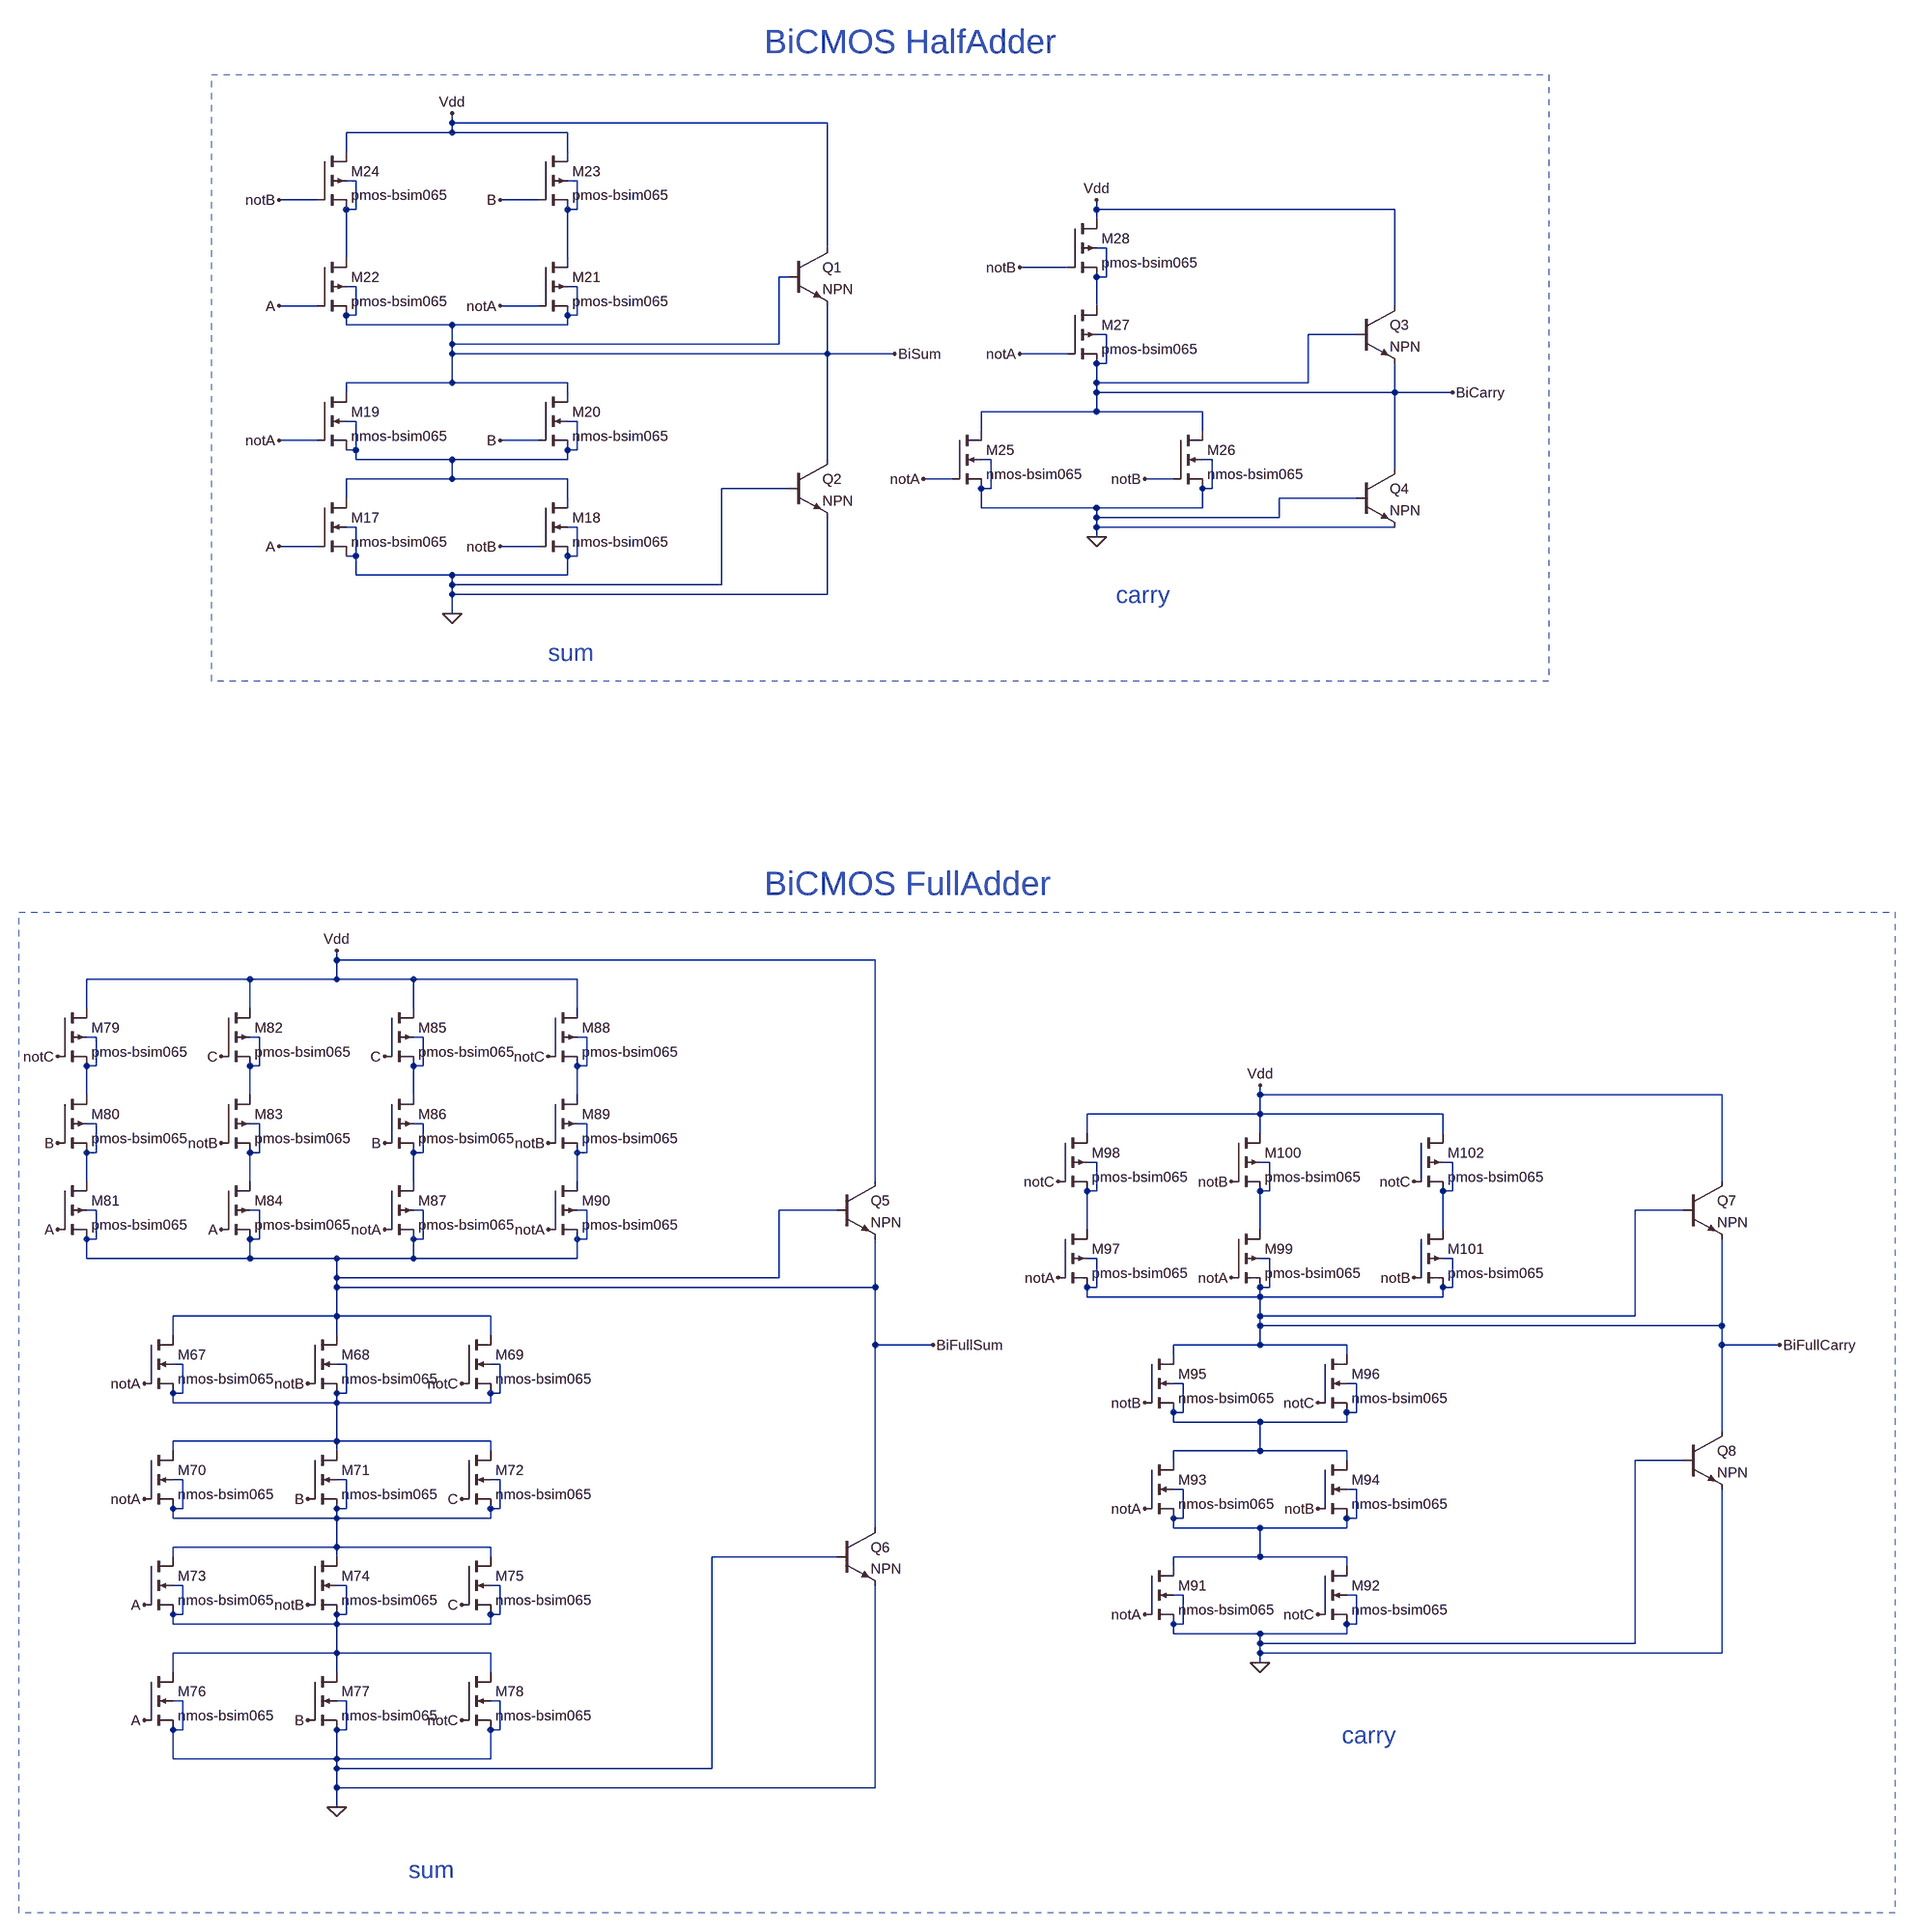
[diagram p0: schematic FullAdder Bicmos.asc]
FullAdder Bicmos.asc, the LTspice schematic file:
Version 4.1
SHEET 1 5276 2964
WIRE -864 -16 -864 -32
WIRE -240 -16 -864 -16
WIRE -864 0 -864 -16
WIRE -864 0 -1040 0
WIRE -672 0 -864 0
WIRE -1040 32 -1040 0
WIRE -672 32 -672 0
WIRE -1024 80 -1040 80
WIRE -656 80 -672 80
WIRE -1088 112 -1152 112
WIRE -720 112 -784 112
WIRE -1024 128 -1024 80
WIRE -1024 128 -1040 128
WIRE -656 128 -656 80
WIRE -656 128 -672 128
WIRE 208 128 208 112
WIRE 704 128 208 128
WIRE 208 144 208 128
WIRE -240 192 -240 -16
WIRE 224 192 208 192
WIRE -1040 208 -1040 128
WIRE -672 208 -672 128
WIRE 160 224 80 224
WIRE -304 240 -320 240
WIRE 224 240 224 192
WIRE 224 240 208 240
WIRE -1024 256 -1040 256
WIRE -656 256 -672 256
WIRE -1088 288 -1152 288
WIRE -720 288 -784 288
WIRE 208 288 208 240
WIRE 704 288 704 128
WIRE -1024 304 -1024 256
WIRE -1024 304 -1040 304
WIRE -656 304 -656 256
WIRE -656 304 -672 304
WIRE -1040 320 -1040 304
WIRE -864 320 -1040 320
WIRE -672 320 -672 304
WIRE -672 320 -864 320
WIRE 224 336 208 336
WIRE 640 336 560 336
WIRE -864 352 -864 320
WIRE -320 352 -320 240
WIRE -320 352 -864 352
WIRE -864 368 -864 352
WIRE -240 368 -240 288
WIRE -240 368 -864 368
WIRE -128 368 -240 368
WIRE 160 368 80 368
WIRE 224 384 224 336
WIRE 224 384 208 384
WIRE -864 416 -864 368
WIRE -864 416 -1040 416
WIRE -672 416 -864 416
WIRE 208 416 208 384
WIRE 560 416 560 336
WIRE 560 416 208 416
WIRE -1040 432 -1040 416
WIRE -672 432 -672 416
WIRE 208 432 208 416
WIRE 704 432 704 384
WIRE 704 432 208 432
WIRE 800 432 704 432
WIRE 208 464 208 432
WIRE 208 464 16 464
WIRE 384 464 208 464
WIRE -1024 480 -1040 480
WIRE -656 480 -672 480
WIRE 16 496 16 464
WIRE 384 496 384 464
WIRE -1088 512 -1152 512
WIRE -720 512 -784 512
WIRE -1024 528 -1024 480
WIRE -1024 528 -1040 528
WIRE -656 528 -656 480
WIRE -656 528 -672 528
WIRE -1024 544 -1024 528
WIRE -864 544 -1024 544
WIRE -672 544 -672 528
WIRE -672 544 -864 544
WIRE -240 544 -240 368
WIRE 32 544 16 544
WIRE 400 544 384 544
WIRE 704 560 704 432
WIRE -864 576 -864 544
WIRE -864 576 -1040 576
WIRE -672 576 -864 576
WIRE -32 576 -80 576
WIRE 336 576 288 576
WIRE -304 592 -416 592
WIRE 32 592 32 544
WIRE 32 592 16 592
WIRE 400 592 400 544
WIRE 400 592 384 592
WIRE -1040 608 -1040 576
WIRE -672 608 -672 576
WIRE 640 608 512 608
WIRE 16 624 16 592
WIRE 208 624 16 624
WIRE 384 624 384 592
WIRE 384 624 208 624
WIRE 208 640 208 624
WIRE 512 640 512 608
WIRE 512 640 208 640
WIRE -1024 656 -1040 656
WIRE -656 656 -672 656
WIRE 208 656 208 640
WIRE 704 656 208 656
WIRE 208 672 208 656
WIRE -1088 688 -1152 688
WIRE -720 688 -784 688
WIRE -1024 704 -1024 656
WIRE -1024 704 -1040 704
WIRE -656 704 -656 656
WIRE -656 704 -672 704
WIRE -1024 736 -1024 704
WIRE -864 736 -1024 736
WIRE -672 736 -672 704
WIRE -672 736 -864 736
WIRE -864 752 -864 736
WIRE -416 752 -416 592
WIRE -416 752 -864 752
WIRE -864 768 -864 752
WIRE -240 768 -240 640
WIRE -240 768 -864 768
WIRE -864 800 -864 768
WIRE -1056 1376 -1056 1360
WIRE -160 1376 -1056 1376
WIRE -1200 1408 -1472 1408
WIRE -1056 1408 -1056 1376
WIRE -1056 1408 -1200 1408
WIRE -928 1408 -1056 1408
WIRE -656 1408 -928 1408
WIRE -1472 1456 -1472 1408
WIRE -1200 1456 -1200 1408
WIRE -928 1456 -928 1408
WIRE -656 1456 -656 1408
WIRE -1456 1504 -1472 1504
WIRE -1184 1504 -1200 1504
WIRE -912 1504 -928 1504
WIRE -640 1504 -656 1504
WIRE -1456 1552 -1456 1504
WIRE -1456 1552 -1472 1552
WIRE -1184 1552 -1184 1504
WIRE -1184 1552 -1200 1552
WIRE -912 1552 -912 1504
WIRE -912 1552 -928 1552
WIRE -640 1552 -640 1504
WIRE -640 1552 -656 1552
WIRE -1472 1600 -1472 1552
WIRE -1200 1600 -1200 1552
WIRE -928 1600 -928 1552
WIRE -656 1600 -656 1552
WIRE 480 1600 480 1584
WIRE 1248 1600 480 1600
WIRE 480 1632 480 1600
WIRE 480 1632 192 1632
WIRE 784 1632 480 1632
WIRE -1456 1648 -1472 1648
WIRE -1184 1648 -1200 1648
WIRE -912 1648 -928 1648
WIRE -640 1648 -656 1648
WIRE 192 1664 192 1632
WIRE 480 1664 480 1632
WIRE 784 1664 784 1632
WIRE -1456 1696 -1456 1648
WIRE -1456 1696 -1472 1696
WIRE -1184 1696 -1184 1648
WIRE -1184 1696 -1200 1696
WIRE -912 1696 -912 1648
WIRE -912 1696 -928 1696
WIRE -640 1696 -640 1648
WIRE -640 1696 -656 1696
WIRE 208 1712 192 1712
WIRE 496 1712 480 1712
WIRE 800 1712 784 1712
WIRE -1472 1744 -1472 1696
WIRE -1200 1744 -1200 1696
WIRE -928 1744 -928 1696
WIRE -656 1744 -656 1696
WIRE -160 1744 -160 1376
WIRE 1248 1744 1248 1600
WIRE 208 1760 208 1712
WIRE 208 1760 192 1760
WIRE 496 1760 496 1712
WIRE 496 1760 480 1760
WIRE 800 1760 800 1712
WIRE 800 1760 784 1760
WIRE -1456 1792 -1472 1792
WIRE -1184 1792 -1200 1792
WIRE -912 1792 -928 1792
WIRE -640 1792 -656 1792
WIRE -224 1792 -320 1792
WIRE 1184 1792 1104 1792
WIRE 192 1824 192 1760
WIRE 480 1824 480 1760
WIRE 784 1824 784 1760
WIRE -1456 1840 -1456 1792
WIRE -1456 1840 -1472 1840
WIRE -1184 1840 -1184 1792
WIRE -1184 1840 -1200 1840
WIRE -912 1840 -912 1792
WIRE -912 1840 -928 1840
WIRE -640 1840 -640 1792
WIRE -640 1840 -656 1840
WIRE -1472 1872 -1472 1840
WIRE -1200 1872 -1200 1840
WIRE -1200 1872 -1472 1872
WIRE -1056 1872 -1200 1872
WIRE -928 1872 -928 1840
WIRE -928 1872 -1056 1872
WIRE -656 1872 -656 1840
WIRE -656 1872 -928 1872
WIRE 208 1872 192 1872
WIRE 496 1872 480 1872
WIRE 800 1872 784 1872
WIRE -1056 1904 -1056 1872
WIRE -320 1904 -320 1792
WIRE -320 1904 -1056 1904
WIRE -1056 1920 -1056 1904
WIRE -160 1920 -160 1840
WIRE -160 1920 -1056 1920
WIRE 208 1920 208 1872
WIRE 208 1920 192 1920
WIRE 496 1920 496 1872
WIRE 496 1920 480 1920
WIRE 800 1920 800 1872
WIRE 800 1920 784 1920
WIRE 192 1936 192 1920
WIRE 480 1936 480 1920
WIRE 480 1936 192 1936
WIRE 784 1936 784 1920
WIRE 784 1936 480 1936
WIRE -1056 1968 -1056 1920
WIRE -1056 1968 -1328 1968
WIRE -800 1968 -1056 1968
WIRE 480 1968 480 1936
WIRE 1104 1968 1104 1792
WIRE 1104 1968 480 1968
WIRE 480 1984 480 1968
WIRE 1248 1984 1248 1840
WIRE 1248 1984 480 1984
WIRE -1328 2000 -1328 1968
WIRE -1056 2000 -1056 1968
WIRE -800 2000 -800 1968
WIRE -160 2016 -160 1920
WIRE -64 2016 -160 2016
WIRE 480 2016 480 1984
WIRE 480 2016 336 2016
WIRE 624 2016 480 2016
WIRE 1248 2016 1248 1984
WIRE 1344 2016 1248 2016
WIRE 336 2032 336 2016
WIRE 624 2032 624 2016
WIRE -1312 2048 -1328 2048
WIRE -1040 2048 -1056 2048
WIRE -784 2048 -800 2048
WIRE 352 2080 336 2080
WIRE 640 2080 624 2080
WIRE -1312 2096 -1312 2048
WIRE -1312 2096 -1328 2096
WIRE -1040 2096 -1040 2048
WIRE -1040 2096 -1056 2096
WIRE -784 2096 -784 2048
WIRE -784 2096 -800 2096
WIRE -1328 2112 -1328 2096
WIRE -1056 2112 -1056 2096
WIRE -1056 2112 -1328 2112
WIRE -800 2112 -800 2096
WIRE -800 2112 -1056 2112
WIRE 352 2128 352 2080
WIRE 352 2128 336 2128
WIRE 640 2128 640 2080
WIRE 640 2128 624 2128
WIRE 336 2144 336 2128
WIRE 480 2144 336 2144
WIRE 624 2144 624 2128
WIRE 624 2144 480 2144
WIRE 1248 2160 1248 2016
WIRE -1056 2176 -1056 2112
WIRE -1056 2176 -1328 2176
WIRE -800 2176 -1056 2176
WIRE -1328 2192 -1328 2176
WIRE -1056 2192 -1056 2176
WIRE -800 2192 -800 2176
WIRE 480 2192 480 2144
WIRE 480 2192 336 2192
WIRE 624 2192 480 2192
WIRE 336 2208 336 2192
WIRE 624 2208 624 2192
WIRE 1184 2208 1104 2208
WIRE -1312 2240 -1328 2240
WIRE -1040 2240 -1056 2240
WIRE -784 2240 -800 2240
WIRE 352 2256 336 2256
WIRE 640 2256 624 2256
WIRE -1312 2288 -1312 2240
WIRE -1312 2288 -1328 2288
WIRE -1040 2288 -1040 2240
WIRE -1040 2288 -1056 2288
WIRE -784 2288 -784 2240
WIRE -784 2288 -800 2288
WIRE -1328 2304 -1328 2288
WIRE -1056 2304 -1056 2288
WIRE -1056 2304 -1328 2304
WIRE -800 2304 -800 2288
WIRE -800 2304 -1056 2304
WIRE 352 2304 352 2256
WIRE 352 2304 336 2304
WIRE 640 2304 640 2256
WIRE 640 2304 624 2304
WIRE -160 2320 -160 2016
WIRE 336 2320 336 2304
WIRE 480 2320 336 2320
WIRE 624 2320 624 2304
WIRE 624 2320 480 2320
WIRE -1056 2352 -1056 2304
WIRE -1056 2352 -1328 2352
WIRE -800 2352 -1056 2352
WIRE -1328 2368 -1328 2352
WIRE -1056 2368 -1056 2352
WIRE -800 2368 -800 2352
WIRE -224 2368 -432 2368
WIRE 480 2368 480 2320
WIRE 480 2368 336 2368
WIRE 624 2368 480 2368
WIRE 336 2384 336 2368
WIRE 624 2384 624 2368
WIRE -1312 2416 -1328 2416
WIRE -1040 2416 -1056 2416
WIRE -784 2416 -800 2416
WIRE 352 2432 336 2432
WIRE 640 2432 624 2432
WIRE -1312 2464 -1312 2416
WIRE -1312 2464 -1328 2464
WIRE -1040 2464 -1040 2416
WIRE -1040 2464 -1056 2464
WIRE -784 2464 -784 2416
WIRE -784 2464 -800 2464
WIRE -1328 2480 -1328 2464
WIRE -1056 2480 -1056 2464
WIRE -1056 2480 -1328 2480
WIRE -800 2480 -800 2464
WIRE -800 2480 -1056 2480
WIRE 352 2480 352 2432
WIRE 352 2480 336 2480
WIRE 640 2480 640 2432
WIRE 640 2480 624 2480
WIRE 336 2496 336 2480
WIRE 480 2496 336 2496
WIRE 624 2496 624 2480
WIRE 624 2496 480 2496
WIRE 480 2512 480 2496
WIRE 1104 2512 1104 2208
WIRE 1104 2512 480 2512
WIRE -1056 2528 -1056 2480
WIRE -1056 2528 -1328 2528
WIRE -800 2528 -1056 2528
WIRE 480 2528 480 2512
WIRE 1248 2528 1248 2256
WIRE 1248 2528 480 2528
WIRE 480 2544 480 2528
WIRE -1328 2560 -1328 2528
WIRE -1056 2560 -1056 2528
WIRE -800 2560 -800 2528
WIRE -1312 2608 -1328 2608
WIRE -1040 2608 -1056 2608
WIRE -784 2608 -800 2608
WIRE -1312 2656 -1312 2608
WIRE -1312 2656 -1328 2656
WIRE -1040 2656 -1040 2608
WIRE -1040 2656 -1056 2656
WIRE -784 2656 -784 2608
WIRE -784 2656 -800 2656
WIRE -1328 2704 -1328 2656
WIRE -1056 2704 -1056 2656
WIRE -1056 2704 -1328 2704
WIRE -800 2704 -800 2656
WIRE -800 2704 -1056 2704
WIRE -1056 2720 -1056 2704
WIRE -432 2720 -432 2368
WIRE -432 2720 -1056 2720
WIRE -1056 2752 -1056 2720
WIRE -160 2752 -160 2416
WIRE -160 2752 -1056 2752
WIRE -1056 2784 -1056 2752
FLAG -864 800 0
FLAG -864 -32 Vdd
FLAG -1152 688 A
FLAG -1152 288 A
FLAG -1152 512 notA
FLAG -784 288 notA
FLAG -784 512 B
FLAG -784 112 B
FLAG -1152 112 notB
FLAG -784 688 notB
FLAG 208 672 0
FLAG 208 112 Vdd
FLAG -80 576 notA
FLAG 80 368 notA
FLAG 288 576 notB
FLAG 80 224 notB
FLAG -128 368 BiSum
FLAG 800 432 BiCarry
FLAG -1056 2784 0
FLAG -1376 2640 A
FLAG -1376 2448 A
FLAG -1376 2272 notA
FLAG -1376 2080 notA
FLAG -1104 2640 B
FLAG -1104 2272 B
FLAG -848 2448 C
FLAG -848 2272 C
FLAG -1104 2448 notB
FLAG -1104 2080 notB
FLAG -848 2080 notC
FLAG -848 2640 notC
FLAG -1520 1824 A
FLAG -1248 1824 A
FLAG -976 1824 notA
FLAG -704 1824 notA
FLAG -1520 1680 B
FLAG -976 1680 B
FLAG -1248 1680 notB
FLAG -704 1680 notB
FLAG -1248 1536 C
FLAG -976 1536 C
FLAG -1520 1536 notC
FLAG -704 1536 notC
FLAG -1056 1360 Vdd
FLAG 480 2544 0
FLAG 288 2464 notA
FLAG 288 2288 notA
FLAG 576 2464 notC
FLAG 576 2112 notC
FLAG 576 2288 notB
FLAG 288 2112 notB
FLAG 144 1904 notA
FLAG 432 1904 notA
FLAG 432 1744 notB
FLAG 736 1904 notB
FLAG 736 1744 notC
FLAG 144 1744 notC
FLAG 480 1584 Vdd
FLAG -64 2016 BiFullSum
FLAG 1344 2016 BiFullCarry
SYMBOL nmos4 -1088 608 R0
SYMATTR InstName M17
SYMATTR Value nmos-bsim065
SYMATTR Value2 l=70n w=160n
SYMBOL nmos4 -720 608 R0
SYMATTR InstName M18
SYMATTR Value nmos-bsim065
SYMATTR Value2 l=70n w=160n
SYMBOL nmos4 -1088 432 R0
SYMATTR InstName M19
SYMATTR Value nmos-bsim065
SYMATTR Value2 l=70n w=160n
SYMBOL nmos4 -720 432 R0
SYMATTR InstName M20
SYMATTR Value nmos-bsim065
SYMATTR Value2 l=70n w=160n
SYMBOL pmos4 -720 208 R0
SYMATTR InstName M21
SYMATTR Value pmos-bsim065
SYMATTR Value2 l=70n w=200n
SYMBOL pmos4 -1088 208 R0
SYMATTR InstName M22
SYMATTR Value pmos-bsim065
SYMATTR Value2 l=70n w=200n
SYMBOL pmos4 -720 32 R0
SYMATTR InstName M23
SYMATTR Value pmos-bsim065
SYMATTR Value2 l=70n w=200n
SYMBOL pmos4 -1088 32 R0
SYMATTR InstName M24
SYMATTR Value pmos-bsim065
SYMATTR Value2 l=70n w=200n
SYMBOL nmos4 -32 496 R0
SYMATTR InstName M25
SYMATTR Value nmos-bsim065
SYMATTR Value2 l=70n w=160n
SYMBOL nmos4 336 496 R0
SYMATTR InstName M26
SYMATTR Value nmos-bsim065
SYMATTR Value2 l=70n w=160n
SYMBOL pmos4 160 288 R0
SYMATTR InstName M27
SYMATTR Value pmos-bsim065
SYMATTR Value2 l=70n w=200n
SYMBOL pmos4 160 144 R0
SYMATTR InstName M28
SYMATTR Value pmos-bsim065
SYMATTR Value2 l=70n w=200n
SYMBOL npn -304 192 R0
SYMATTR InstName Q1
SYMBOL npn -304 544 R0
SYMATTR InstName Q2
SYMBOL npn 640 288 R0
SYMATTR InstName Q3
SYMBOL npn 640 560 R0
SYMATTR InstName Q4
SYMBOL nmos4 -1376 2000 R0
SYMATTR InstName M67
SYMATTR Value nmos-bsim065
SYMATTR Value2 l=70n w=160n
SYMBOL nmos4 -1104 2000 R0
SYMATTR InstName M68
SYMATTR Value nmos-bsim065
SYMATTR Value2 l=70n w=160n
SYMBOL nmos4 -848 2000 R0
SYMATTR InstName M69
SYMATTR Value nmos-bsim065
SYMATTR Value2 l=70n w=160n
SYMBOL nmos4 -1376 2192 R0
SYMATTR InstName M70
SYMATTR Value nmos-bsim065
SYMATTR Value2 l=70n w=160n
SYMBOL nmos4 -1104 2192 R0
SYMATTR InstName M71
SYMATTR Value nmos-bsim065
SYMATTR Value2 l=70n w=160n
SYMBOL nmos4 -848 2192 R0
SYMATTR InstName M72
SYMATTR Value nmos-bsim065
SYMATTR Value2 l=70n w=160n
SYMBOL nmos4 -1376 2368 R0
SYMATTR InstName M73
SYMATTR Value nmos-bsim065
SYMATTR Value2 l=70n w=160n
SYMBOL nmos4 -1104 2368 R0
SYMATTR InstName M74
SYMATTR Value nmos-bsim065
SYMATTR Value2 l=70n w=160n
SYMBOL nmos4 -848 2368 R0
SYMATTR InstName M75
SYMATTR Value nmos-bsim065
SYMATTR Value2 l=70n w=160n
SYMBOL nmos4 -1376 2560 R0
SYMATTR InstName M76
SYMATTR Value nmos-bsim065
SYMATTR Value2 l=70n w=160n
SYMBOL nmos4 -1104 2560 R0
SYMATTR InstName M77
SYMATTR Value nmos-bsim065
SYMATTR Value2 l=70n w=160n
SYMBOL nmos4 -848 2560 R0
SYMATTR InstName M78
SYMATTR Value nmos-bsim065
SYMATTR Value2 l=70n w=160n
SYMBOL pmos4 -1520 1456 R0
SYMATTR InstName M79
SYMATTR Value pmos-bsim065
SYMATTR Value2 l=70n w=200n
SYMBOL pmos4 -1520 1600 R0
SYMATTR InstName M80
SYMATTR Value pmos-bsim065
SYMATTR Value2 l=70n w=200n
SYMBOL pmos4 -1520 1744 R0
SYMATTR InstName M81
SYMATTR Value pmos-bsim065
SYMATTR Value2 l=70n w=200n
SYMBOL pmos4 -1248 1456 R0
SYMATTR InstName M82
SYMATTR Value pmos-bsim065
SYMATTR Value2 l=70n w=200n
SYMBOL pmos4 -1248 1600 R0
SYMATTR InstName M83
SYMATTR Value pmos-bsim065
SYMATTR Value2 l=70n w=200n
SYMBOL pmos4 -1248 1744 R0
SYMATTR InstName M84
SYMATTR Value pmos-bsim065
SYMATTR Value2 l=70n w=200n
SYMBOL pmos4 -976 1456 R0
SYMATTR InstName M85
SYMATTR Value pmos-bsim065
SYMATTR Value2 l=70n w=200n
SYMBOL pmos4 -976 1600 R0
SYMATTR InstName M86
SYMATTR Value pmos-bsim065
SYMATTR Value2 l=70n w=200n
SYMBOL pmos4 -976 1744 R0
SYMATTR InstName M87
SYMATTR Value pmos-bsim065
SYMATTR Value2 l=70n w=200n
SYMBOL pmos4 -704 1456 R0
SYMATTR InstName M88
SYMATTR Value pmos-bsim065
SYMATTR Value2 l=70n w=200n
SYMBOL pmos4 -704 1600 R0
SYMATTR InstName M89
SYMATTR Value pmos-bsim065
SYMATTR Value2 l=70n w=200n
SYMBOL pmos4 -704 1744 R0
SYMATTR InstName M90
SYMATTR Value pmos-bsim065
SYMATTR Value2 l=70n w=200n
SYMBOL nmos4 288 2384 R0
SYMATTR InstName M91
SYMATTR Value nmos-bsim065
SYMATTR Value2 l=70n w=160n
SYMBOL nmos4 576 2384 R0
SYMATTR InstName M92
SYMATTR Value nmos-bsim065
SYMATTR Value2 l=70n w=160n
SYMBOL nmos4 288 2208 R0
SYMATTR InstName M93
SYMATTR Value nmos-bsim065
SYMATTR Value2 l=70n w=160n
SYMBOL nmos4 576 2208 R0
SYMATTR InstName M94
SYMATTR Value nmos-bsim065
SYMATTR Value2 l=70n w=160n
SYMBOL nmos4 288 2032 R0
SYMATTR InstName M95
SYMATTR Value nmos-bsim065
SYMATTR Value2 l=70n w=160n
SYMBOL nmos4 576 2032 R0
SYMATTR InstName M96
SYMATTR Value nmos-bsim065
SYMATTR Value2 l=70n w=160n
SYMBOL pmos4 144 1824 R0
SYMATTR InstName M97
SYMATTR Value pmos-bsim065
SYMATTR Value2 l=70n w=200n
SYMBOL pmos4 144 1664 R0
SYMATTR InstName M98
SYMATTR Value pmos-bsim065
SYMATTR Value2 l=70n w=200n
SYMBOL pmos4 432 1824 R0
SYMATTR InstName M99
SYMATTR Value pmos-bsim065
SYMATTR Value2 l=70n w=200n
SYMBOL pmos4 432 1664 R0
SYMATTR InstName M100
SYMATTR Value pmos-bsim065
SYMATTR Value2 l=70n w=200n
SYMBOL pmos4 736 1824 R0
SYMATTR InstName M101
SYMATTR Value pmos-bsim065
SYMATTR Value2 l=70n w=200n
SYMBOL pmos4 736 1664 R0
SYMATTR InstName M102
SYMATTR Value pmos-bsim065
SYMATTR Value2 l=70n w=200n
SYMBOL npn -224 1744 R0
SYMATTR InstName Q5
SYMBOL npn -224 2320 R0
SYMATTR InstName Q6
SYMBOL npn 1184 1744 R0
SYMATTR InstName Q7
SYMBOL npn 1184 2160 R0
SYMATTR InstName Q8
TEXT -344 -152 Left 5 ;BiCMOS HalfAdder
TEXT -704 864 Left 4 ;sum
TEXT 240 768 Left 4 ;carry
TEXT -344 1248 Left 5 ;BiCMOS FullAdder
TEXT -936 2888 Left 4 ;sum
TEXT 616 2664 Left 4 ;carry
RECTANGLE Normal 960 912 -1264 -96 2
RECTANGLE Normal 1536 2960 -1584 1296 2

The netlist it stands for:
* FullAdder Bicmos.asc
M17 N004 A 0 0 nmos-bsim065 l=70n w=160n
M18 N004 notB 0 0 nmos-bsim065 l=70n w=160n
M19 BiSum notA N004 N004 nmos-bsim065 l=70n w=160n
M20 BiSum B N004 N004 nmos-bsim065 l=70n w=160n
M21 N002 notA BiSum BiSum pmos-bsim065 l=70n w=200n
M22 N001 A BiSum BiSum pmos-bsim065 l=70n w=200n
M23 Vdd B N002 N002 pmos-bsim065 l=70n w=200n
M24 Vdd notB N001 N001 pmos-bsim065 l=70n w=200n
M25 BiCarry notA 0 0 nmos-bsim065 l=70n w=160n
M26 BiCarry notB 0 0 nmos-bsim065 l=70n w=160n
M27 N003 notA BiCarry BiCarry pmos-bsim065 l=70n w=200n
M28 Vdd notB N003 N003 pmos-bsim065 l=70n w=200n
Q1 Vdd BiSum BiSum 0 NPN
Q2 BiSum 0 0 0 NPN
Q3 Vdd BiCarry BiCarry 0 NPN
Q4 BiCarry 0 0 0 NPN
M67 BiFullSum notA N016 N016 nmos-bsim065 l=70n w=160n
M68 BiFullSum notB N016 N016 nmos-bsim065 l=70n w=160n
M69 BiFullSum notC N016 N016 nmos-bsim065 l=70n w=160n
M70 N016 notA N018 N018 nmos-bsim065 l=70n w=160n
M71 N016 B N018 N018 nmos-bsim065 l=70n w=160n
M72 N016 C N018 N018 nmos-bsim065 l=70n w=160n
M73 N018 A N020 N020 nmos-bsim065 l=70n w=160n
M74 N018 notB N020 N020 nmos-bsim065 l=70n w=160n
M75 N018 C N020 N020 nmos-bsim065 l=70n w=160n
M76 N020 A 0 0 nmos-bsim065 l=70n w=160n
M77 N020 B 0 0 nmos-bsim065 l=70n w=160n
M78 N020 notC 0 0 nmos-bsim065 l=70n w=160n
M79 Vdd notC N005 N005 pmos-bsim065 l=70n w=200n
M80 N005 B N009 N009 pmos-bsim065 l=70n w=200n
M81 N009 A BiFullSum BiFullSum pmos-bsim065 l=70n w=200n
M82 Vdd C N006 N006 pmos-bsim065 l=70n w=200n
M83 N006 notB N010 N010 pmos-bsim065 l=70n w=200n
M84 N010 A BiFullSum BiFullSum pmos-bsim065 l=70n w=200n
M85 Vdd C N007 N007 pmos-bsim065 l=70n w=200n
M86 N007 B N011 N011 pmos-bsim065 l=70n w=200n
M87 N011 notA BiFullSum BiFullSum pmos-bsim065 l=70n w=200n
M88 Vdd notC N008 N008 pmos-bsim065 l=70n w=200n
M89 N008 notB N012 N012 pmos-bsim065 l=70n w=200n
M90 N012 notA BiFullSum BiFullSum pmos-bsim065 l=70n w=200n
M91 N019 notA 0 0 nmos-bsim065 l=70n w=160n
M92 N019 notC 0 0 nmos-bsim065 l=70n w=160n
M93 N017 notA N019 N019 nmos-bsim065 l=70n w=160n
M94 N017 notB N019 N019 nmos-bsim065 l=70n w=160n
M95 BiFullCarry notB N017 N017 nmos-bsim065 l=70n w=160n
M96 BiFullCarry notC N017 N017 nmos-bsim065 l=70n w=160n
M97 N013 notA BiFullCarry BiFullCarry pmos-bsim065 l=70n w=200n
M98 Vdd notC N013 N013 pmos-bsim065 l=70n w=200n
M99 N014 notA BiFullCarry BiFullCarry pmos-bsim065 l=70n w=200n
M100 Vdd notB N014 N014 pmos-bsim065 l=70n w=200n
M101 N015 notB BiFullCarry BiFullCarry pmos-bsim065 l=70n w=200n
M102 Vdd notC N015 N015 pmos-bsim065 l=70n w=200n
Q5 Vdd BiFullSum BiFullSum 0 NPN
Q6 BiFullSum 0 0 0 NPN
Q7 Vdd BiFullCarry BiFullCarry 0 NPN
Q8 BiFullCarry 0 0 0 NPN
.model NPN NPN
.model PNP PNP
.lib standard.bjt
.model NMOS NMOS
.model PMOS PMOS
.lib standard.mos
* BiCMOS HalfAdder
* sum
* carry
* BiCMOS FullAdder
* sum
* carry
.backanno
.end